# EAGLE design ATtiny20 Study - UFBGA15 (EAGLE 7.2.0)
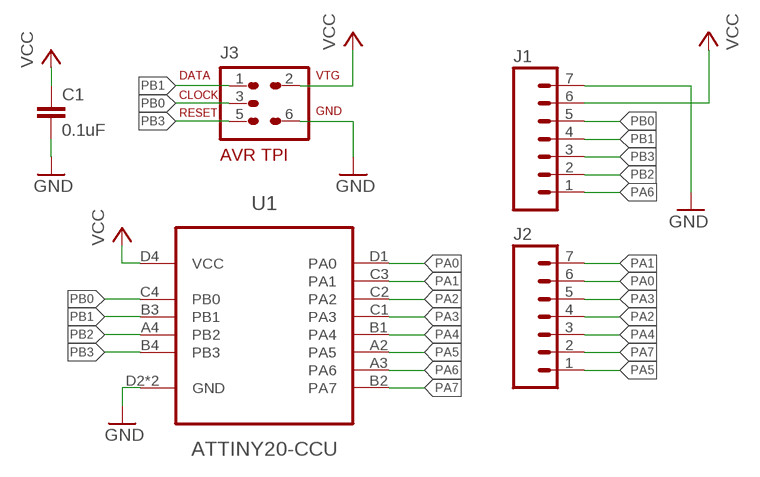
[diagram p0: schematic, sheet 1]

## Parts
C1  0.1uF  CAP0402-CAP  [0402-CAP]
J1  M07  [1X07]
J2  M07  [1X07]
J3  AVR-TPIVERT  [AVR-ISP-6]
U1  ATTINY20-CCU  [15CC1]

## Nets
GND: C1.2 J1.7 J3.6 U1.D2(GND) U1.D3(GND)
PA0: J2.6 U1.D1(PA0)
PA1: J2.7 U1.C3(PA1)
PA2: J2.4 U1.C2(PA2)
PA3: J2.5 U1.C1(PA3)
PA4: J2.3 U1.B1(PA4)
PA5: J2.1 U1.A2(PA5)
PA6: J1.1 U1.A3(PA6)
PA7: J2.2 U1.B2(PA7)
PB0: J1.5 J3.3 U1.C4(PB0)
PB1: J1.4 J3.1 U1.B3(PB1)
PB2: J1.2 U1.A4(PB2)
PB3: J1.3 J3.5 U1.B4(PB3)
VCC: C1.1 J1.6 J3.2 U1.D4(VCC)

## Library data of the parts
C1 = SparkFun-Capacitors:CAP: Capacitor Standard 0603 ceramic capacitor, and 0.1" leaded capacitor.
J1 J2 = SparkFun-Connectors:M07: Header 7 Standard 7-pin 0.1" header. Use with straight break away headers (SKU : PRT-00116), right angle break away headers (PRT-00553), swiss pins (PRT-00743), machine pins (PRT-00117), and female headers (PRT-00115). NOTES ON THE VARIANTS LOCK and LOCK_LONGPADS... This footprint was designed to help hold the alignment of a through-hole component (i.e. 7-pin header) while soldering it into place. You may notice that each hole has been shifted either up or down by 0.005 of an inch from it's more standard position (which is usually a perfectly straight line). This slight alteration caused the pins (the squares in the middle) to touch the edges of the holes. Because they are alternating, it causes a "brace" to hold the header in place. 0.005 has proven to be the perfect amount of "off-center" position when using our standard breakaway headers. Although looks a little odd when you look at the bare footprint, once you have a header in there, the alteration is very hard to notice. Also, if you push a header all the way into place, it is covered up entirely on the bottom side. This idea of altering the position of holes to aid alignment will be further integrated into the Sparkfun Library for other footprints. It can help hold any component with 3 or more connection pins.
J3 = avr-7:AVR-TPI: AVR TPI connector
U1 = Atmel_AVR8:ATTINY20: 8-bit Microcontroller with Bytes In-System Programmable Flash

## Board
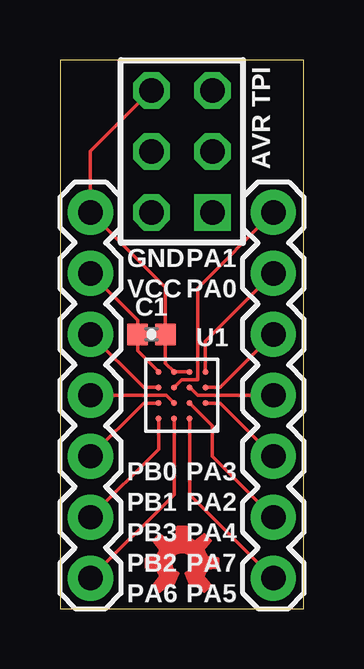
[diagram p1: board, top side]
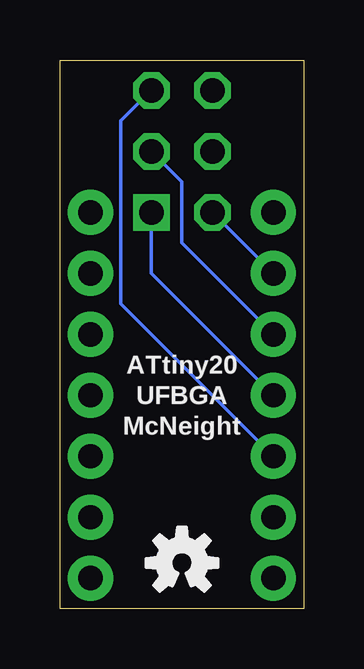
[diagram p2: board, bottom side, seen from below]

Size 10.16 x 22.86 mm. Coordinates in mm from the lower left corner, seen from the top.
Outline: 0,0 10.16,0 10.16,22.86 0,22.86 0,0
Copper layers (1*16): Top 0.0356mm / dielectric 1.5011mm / Bottom 0.0356mm
Design rules "oshpark-2layer": minimum track width 6mil, minimum drill 13mil, track to track 6mil, track to pad 6mil, pad to pad 6mil, via to via 6mil, smd to smd 6mil, copper to edge 15mil, drill to drill 6mil, minimum pad ring 7mil, minimum via ring 7mil, stop-mask expansion 4mil, vias tented up to drill 0mil, thermal gap 10mil

### Footprints (pad centres in the part's own frame; a part is rotated, then mirrored left to right if it is on the bottom)
0402-CAP = smd 0.85 x 0.9: 1 -0.58,0; 2 0.58,0
1X07 = drill 1.016 pad 1.88: 1 0,0; 2 2.54,0; 3 5.08,0; 4 7.62,0; 5 10.16,0; 6 12.7,0; 7 15.24,0
AVR-ISP-6 = drill 1.016 square: 1 -2.54,-1.27 | drill 1.016 octagon: 2 -2.54,1.27; 3 0,-1.27; 4 0,1.27; 5 2.54,-1.27; 6 2.54,1.27
15CC1 = smd 0.25 x 0.25: A2 -0.325,0.975; A3 0.325,0.975; A4 0.975,0.975; B1 -0.975,0.325; B2 -0.325,0.325; B3 0.325,0.325; B4 0.975,0.325; C1 -0.975,-0.325; C2 -0.325,-0.325; C3 0.325,-0.325; C4 0.975,-0.325; D1 -0.975,-0.975; D2 -0.325,-0.975; D3 0.325,-0.975; D4 0.975,-0.975

### Placement (x,y rotation side)
C1  3.81,11.43 0 top
J1  1.27,1.27 90 top
J2  8.89,1.27 90 top
J3  5.08,19.05 90 top
U1  5.08,8.89 180 top
U$1  [OSHW-LOGO-S_COPPER]  5.08,1.91 0 bottom
U$2  [OSHW-LOGO-S_COPPER]  5.08,1.91 0 top
U$3  [OSHW-LOGO-S]  5.08,1.91 0 bottom

### Tracks (layer width: path | path; a pad name or v marks a point on that pad's centre or on a via)
GND
  Top 0.152: J3.6 1.27,19.05 J1.7 4.39,13.39 C1.2 4.39,10.23 U1.D3 U1.D2
PA0
  Top 0.152: J2.6 6.05,11.13 U1.D1
PA1
  Top 0.152: U1.C3 5.08,9.54 5.73,9.54 5.73,13.35 J2.7
PA2
  Top 0.152: U1.C2 5.73,8.89 J2.4
PA3
  Top 0.152: U1.C1 6.67,9.21 J2.5
PA4
  Top 0.152: U1.B1 6.67,8.56 J2.3
PA5
  Top 0.152: U1.A2 5.41,4.75 J2.1
PA6
  Top 0.152: U1.A3 4.75,4.75 J1.1
PA7
  Top 0.152: U1.B2 6.35,7.62 6.35,6.35 J2.2
PB0
  Top 0.152: U1.C4 3.48,9.21 J1.5
  Bottom 0.152: J3.3 5.08,17.78 5.08,15.24 J1.5
PB1
  Top 0.152: U1.B3 4.43,8.89 J1.4
  Bottom 0.152: J3.1 6.35,13.97 J1.4
PB2
  Top 0.152: U1.A4 4.11,6.64 J1.2
PB3
  Top 0.152: U1.B4 3.48,8.56 J1.3
  Bottom 0.152: J3.5 7.62,20.32 7.62,12.7 J1.3
VCC
  Top 0.152: U1.D4 3.23,10.74 C1.1 3.23,12.01 J1.6
  Bottom 0.152: J3.2 J1.6

### Text on the board
tPlace: AVR TPI | GND | PA1 | VCC | PA0 | PB0 | PA3 | PB1 | PA2 | PB3 | PA4 | PB2 | PA7 | PA6 | PA5
bPlace: ATtiny20 | UFBGA | McNeight